# EAGLE design erilabor (EAGLE 7.1.0)
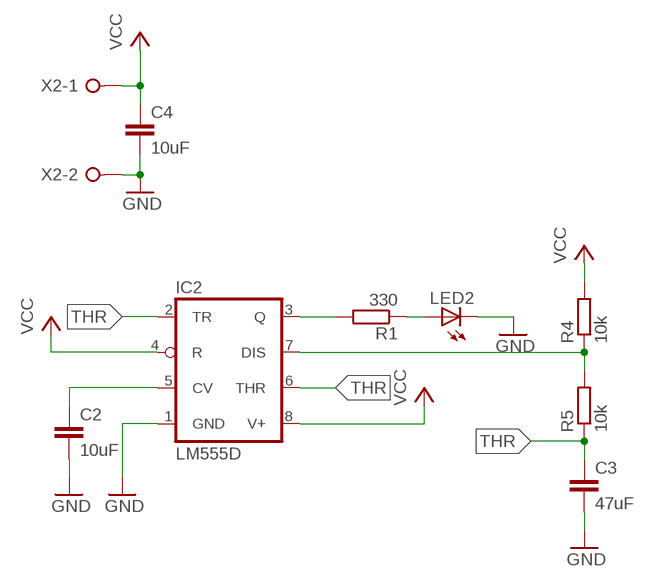
[diagram p0: schematic, sheet 1]

## Parts
C2  10uF  C-EUC0805K  [C0805K]
C3  47uF  C-EUC1210K  [C1210K]
C4  10uF  C-EUC0805K  [C0805K]
IC2  LM555D  [SO08]
LED2  LEDCHIP-LED0603  [CHIP-LED0603]
R1  330  R-EU_R0603  [R0603]
R4  10k  R-EU_R0603  [R0603]
R5  10k  R-EU_R0603  [R0603]
X2  W237-2N  [W237-2N]

## Nets
GND: C2.2 C3.2 C4.2 IC2.1(GND) LED2.C X2.2
N$1: IC2.3(Q) R1.2
N$2: LED2.A R1.1
N$3: C2.1 IC2.5(CV)
N$5: IC2.7(DIS) R4.1 R5.2
THR: C3.1 IC2.2(TR) IC2.6(THR) R5.1
VCC: C4.1 IC2.4(R) IC2.8(V+) R4.2 X2.1

## Library data of the parts
C2-C4 = rcl:C-EU: CAPACITOR, European symbol
IC2 = adafruit:*555: TIMER Changed DIP package to have round (not oval) pin pads http://www.ladyada.net/library/pcb/eaglelibrary.html
LED2 = adafruit:LED: LED OSRAM: - CHIPLED LG R971, LG N971, LY N971, LG Q971, LY Q971, LO R971, LY R971 LH N974, LH R974 LS Q976, LO Q976, LY Q976 LO Q996 - Hyper CHIPLED LW Q18S LB Q993, LB Q99A, LB R99A - SideLED LS A670, LO A670, LY A670, LG A670, LP A670 LB A673, LV A673, LT A673, LW A673 LH A674 LY A675 LS A676, LA A676, LO A676, LY A676, LW A676 LS A679, LY A679, LG A679 - Hyper Micro SIDELED® LS Y876, LA Y876, LO Y876, LY Y876 LT Y87S - SmartLED LW L88C, LW L88S LB L89C, LB L89S, LG L890 LS L89K, LO L89K, LY L89K LS L896, LA L896, LO L896, LY L896 - TOPLED LS T670, LO T670, LY T670, LG T670, LP T670 LSG T670, LSP T670, LSY T670, LOP T670, LYG T670 LG T671, LOG T671, LSG T671 LB T673, LV T673, LT T673, LW T673 LH T674 LS T676, LA T676, LO T676, LY T676, LB T676, LH T676, LSB T676, LW T676 LB T67C, LV T67C, LT T67C, LS T67K, LO T67K, LY T67K, LW E67C LS E67B, LA E67B, LO E67B, LY E67B, LB E67C, LV E67C, LT E67C LW T67C LS T679, LY T679, LG T679 LS T770, LO T770, LY T770, LG T770, LP T770 LB T773, LV T773, LT T773, LW T773 LH T774 LS E675, LA E675, LY E675, LS T675 LS T776, LA T776, LO T776, LY T776, LB T776 LHGB T686 LT T68C, LB T68C - Hyper Mini TOPLED® LB M676 - Mini TOPLED Santana® LG M470 LS M47K, LO M47K, LY M47K Source: http://www.osram.convergy.de/
R1 R4 R5 = rcl:R-EU_: RESISTOR, European symbol
X2 = con-wago-508:W237-2N: WAGO SREW CLAMP; OC_FARNELL: unknown; OC_NEWARK: unknown

## Board
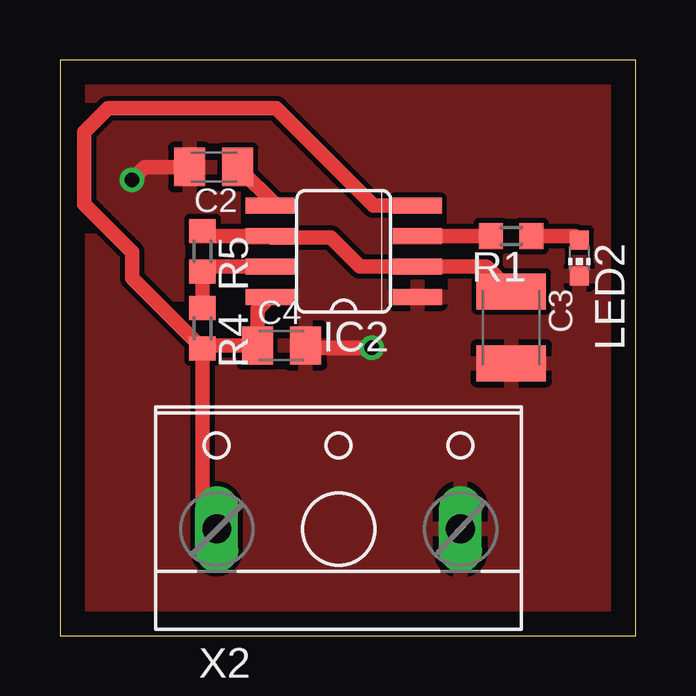
[diagram p1: board, top side]
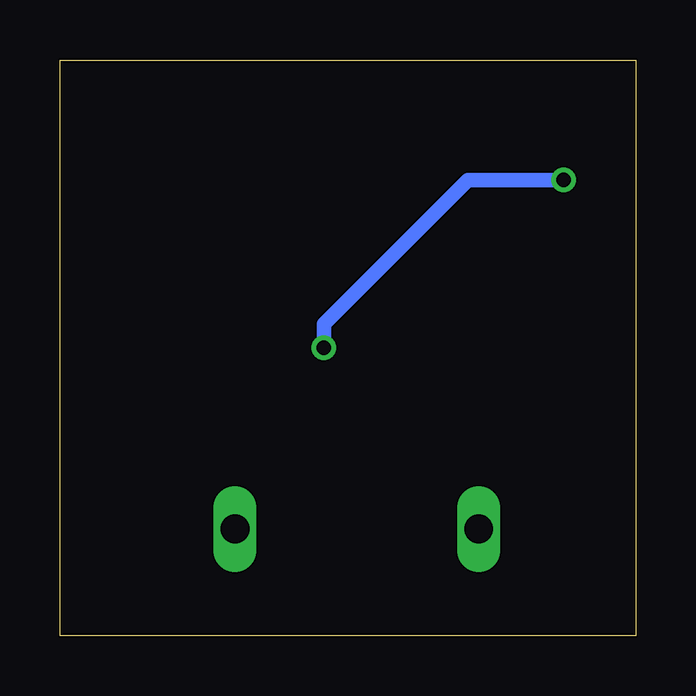
[diagram p2: board, bottom side, seen from below]

Size 24 x 24 mm. Coordinates in mm from the lower left corner, seen from the top.
Outline: 0,0 24,0 24,24 0,24 0,0
Copper layers (1*16): Top 0.035mm / dielectric 1.5mm / Bottom 0.035mm
Design rules "default": minimum track width 10mil, minimum drill 24mil, track to track 8mil, track to pad 8mil, pad to pad 8mil, via to via 8mil, smd to smd 8mil, copper to edge 40mil, drill to drill 8mil, minimum pad ring 10mil, minimum via ring 8mil, stop-mask expansion 4mil, vias tented up to drill 0mil, thermal gap 10mil

### Footprints (pad centres in the part's own frame; a part is rotated, then mirrored left to right if it is on the bottom)
C0805K = smd 1.3 x 1.6: 1 -1,0; 2 1,0
C1210K = smd 1.5 x 2.9: 1 -1.5,0; 2 1.5,0
SO08 = smd 0.66 x 2.032: 1 -1.905,-3.073; 2 -0.635,-3.073; 3 0.635,-3.073; 4 1.905,-3.073; 5 1.905,3.073; 6 0.635,3.073; 7 -0.635,3.073; 8 -1.905,3.073
CHIP-LED0603 = smd 0.8 x 0.8: A 0,-0.75; C 0,0.75
R0603 = smd 1 x 1.1: 1 -0.85,0; 2 0.85,0
W237-2N = drill 1.194 long: 1 -5.08,-0.635; 2 5.08,-0.635

### Placement (x,y rotation side)
C2  6.41,19.54 180 top
C3  18.82,12.85 270 top
C4  9.24,12.1 0 top
IC2  11.83,16.02 90 top
LED2  21.66,15.74 180 top
R1  18.82,16.66 180 top
R4  5.95,12.81 270 top
R5  5.95,16.02 270 top
X2  11.62,5.08 0 top

### Tracks (layer width: path | path; a pad name or v marks a point on that pad's centre or on a via)
GND  (via drill 0.6)
  Top 0.61: IC2.1 | C2.2 3.54,19.54 v3,19 | v13,12 10.34,12 C4.2
  Bottom 0.61: v3,19 7,19 13,13 v13,12
  pour Top: 0,0 24,0 24,24 0,24
N$1
  Top 0.61: R1.2 IC2.3
N$2
  Top 0.61: R1.1 21.49,16.66 LED2.A
N$3
  Top 0.61: C2.1 9.04,17.9 9.3,17.9 9.28,17.93 IC2.5
N$5
  Top 0.61: IC2.7 6.16,15.38 R5.2 R4.1
THR
  Top 0.61: C3.1 17.77,15.38 IC2.2 12.52,15.38 11.3,16.6 8.81,16.6 IC2.6 6.17,16.66 R5.1
VCC
  Top 0.61: IC2.8 8.24,13.6 C4.1 6.08,12.1 R4.2 | R4.2 5.95,5.04 X2.1 | IC2.4 13.07,17.93 9,22 2,22 1,21 1,18 3,16 3,14.91 R4.2